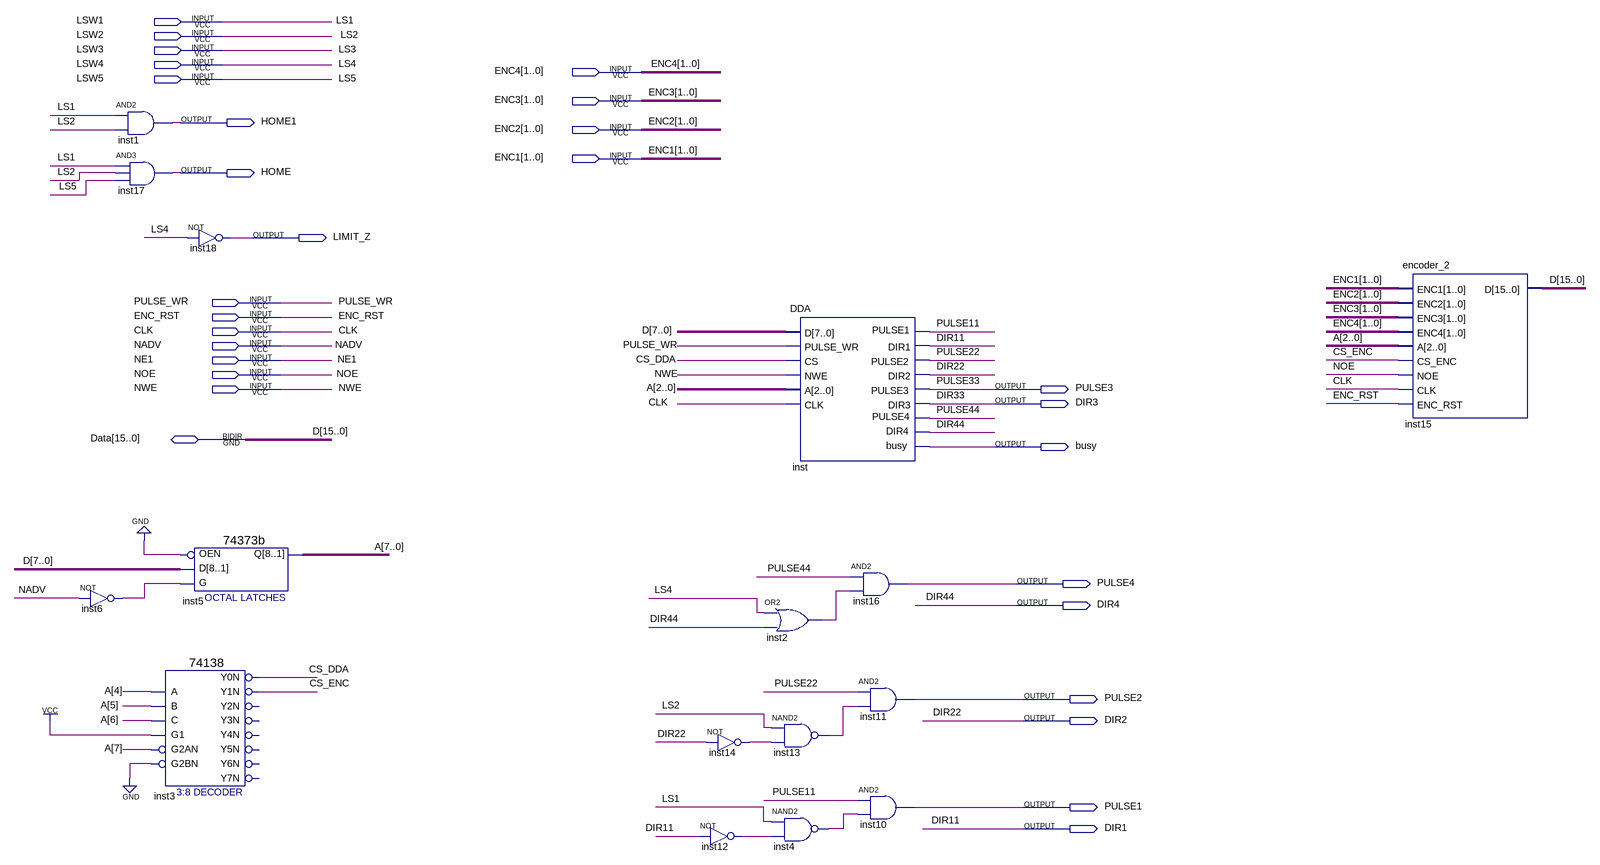
[diagram p0: schematic sheet]
// Quartus schematic xuat_xung.bdf as structural Verilog: 16 symbols, 29 pins
module xuat_xung (
  input  LSW1,
  input  LSW2,
  input  LSW3,
  input  LSW4,
  input  [1:0] ENC4,
  input  LSW5,
  input  [1:0] ENC3,
  input  [1:0] ENC2,
  input  [1:0] ENC1,
  input  PULSE_WR,
  input  ENC_RST,
  input  CLK,
  input  NADV,
  input  NE1,
  input  NOE,
  input  NWE,
  inout  [15:0] Data,
  output HOME1,
  output HOME,
  output LIMIT_Z,
  output PULSE3,
  output DIR3,
  output busy,
  output PULSE4,
  output DIR4,
  output PULSE2,
  output DIR2,
  output PULSE1,
  output DIR1
);

  wire CS_DDA, CS_ENC, inst2_out, inst4_out, inst6_out, inst12_out, inst13_out, inst14_out, PULSE11, PULSE22,
       PULSE44;
  wire [7:0] A;

  not inst6 (inst6_out, NADV);
  and inst1 (HOME1, LSW1, LSW2);
  and inst17 (HOME, LSW1, LSW2, LSW5);
  not inst18 (LIMIT_Z, LSW4);
  \74373b  inst5 (.D(Data[7:0]), .G(inst6_out), .OEN(1'b0), .Q(A));
  \74138  inst3 (
    .A(A[4]), .B(A[5]), .G1(1'b1), .C(A[6]), .G2AN(A[7]), .G2BN(1'b0), .Y0N(CS_DDA), .Y1N(CS_ENC));  // open: Y2N, Y3N, Y4N, Y5N, Y6N, Y7N
  not inst14 (inst14_out, DIR2);
  not inst12 (inst12_out, DIR1);
  or inst2 (inst2_out, LSW4, DIR4);
  nand inst13 (inst13_out, LSW2, inst14_out);
  nand inst4 (inst4_out, LSW1, inst12_out);
  DDA inst (
    .D(Data[7:0]), .PULSE_WR(PULSE_WR), .CS(CS_DDA), .NWE(NWE), .A(A[2:0]), .CLK(CLK), .PULSE1(PULSE11),
    .DIR1(DIR1), .PULSE2(PULSE22), .DIR2(DIR2), .PULSE3(PULSE3), .DIR3(DIR3), .busy(busy), .PULSE4(PULSE44),
    .DIR4(DIR4));
  and inst16 (PULSE4, PULSE44, inst2_out);
  and inst11 (PULSE2, PULSE22, inst13_out);
  and inst10 (PULSE1, PULSE11, inst4_out);
  encoder_2 inst15 (
    .ENC1(ENC1), .ENC2(ENC2), .ENC3(ENC3), .ENC4(ENC4), .A(A[2:0]), .CS_ENC(CS_ENC), .NOE(NOE), .CLK(CLK),
    .ENC_RST(ENC_RST), .D(Data));

  // Other names for the same wires on the sheet: D[15:0] = Data; DIR11 = DIR1; DIR22 = DIR2; DIR33 = DIR3;
  //   DIR44 = DIR4; LS1 = LSW1; LS2 = LSW2; LS3 = LSW3; LS4 = LSW4; LS5 = LSW5; PULSE33 = PULSE3
endmodule
